# Altium schematic sheet Input.SchDoc
size D; SheetNumber: 3; SheetTotal: 3
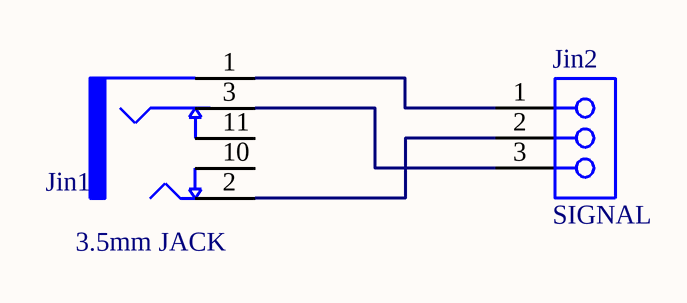
[diagram p0: Input.SchDoc]

## Parts
Jin1  3.5mm JACK  [SWITCHCRAFT_35RAPC4BHN2]
Jin2  SIGNAL  [SMTC-SLW-103-01-X-S]

## Nets
NetJin1_1: Jin1.1 Jin2.1
NetJin1_2: Jin1.2 Jin2.2
NetJin1_3: Jin1.3 Jin2.3

Not connected (* = marked no-connect by the designer): Jin1 10 11

## Library data of the parts
Jin1 = 35RAPC4BHN2: Conn 3.5MM Stereo Jack F 5 POS Solder RA Thru-Hole 5 Terminal 1 Port; MF: {'manufacturer': u'Switchcraft Inc.'}; MP: 35RAPC4BHN2; Availability: Unavailable; Value: *; Package: None; Price: None
Jin2 = CMP-1023-00128-1: Low Profile Socket Strips, Through-hole, Vertical, -55 to 125 degC, 2.54 mm Pitch, 3-Pin, Female, RoHS; Manufacturer: Samtec; PartNumber: SLW-103-01-G-S; Pitch: 2.54 mm; ComponentLink2URL: http://www.samtec.com/documents/webfiles/pdf/SLW.PDF; PackageVersion: X, 9/1987; ComponentLink2Description: Datasheet; Mounting Technology: Through-hole; RoHS: True; ComponentLink3URL: http://www.samtec.com/documents/webfiles/cpdf/SLW-1XX-01-X-X-MKT.pdf; PackageDescription: Low Profile Socket Strip; Temperature Range: -55 to 125 degC; DatasheetVersion: F-214; ComponentLink1Description: Manufacturer URL; ComponentLink1URL: http://www.samtec.com; Orientation: Vertical; PackageReference: SLW-103-01-X-S; ComponentLink3Description: Package Specification